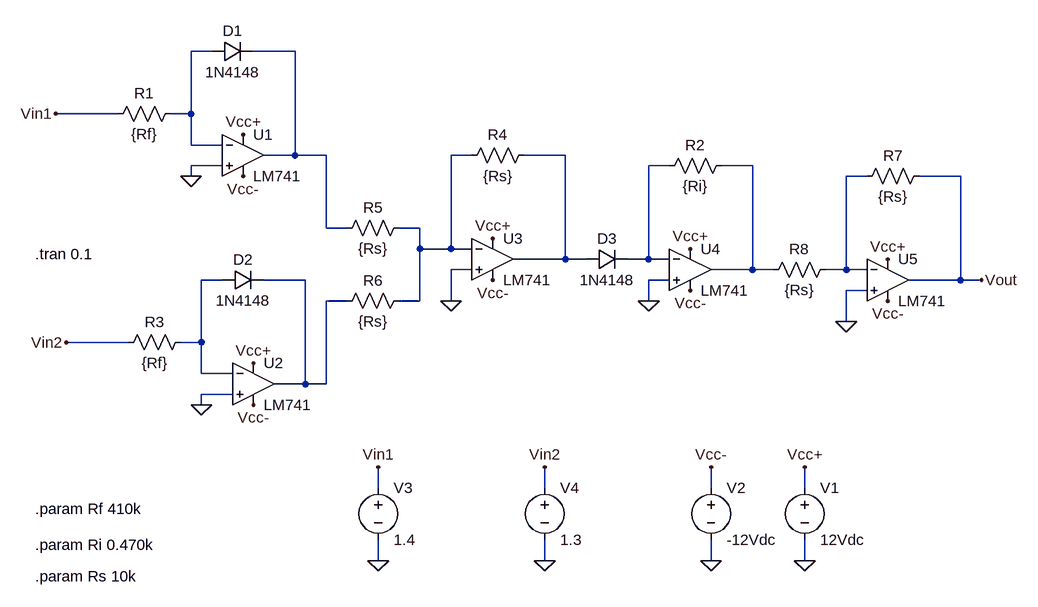
[diagram p0: schematic LtSpice - Schematic.asc]
LtSpice - Schematic.asc, the LTspice schematic file:
Version 4.1
SHEET 1 1108 948
WIRE -352 -304 -384 -304
WIRE -224 -304 -288 -304
WIRE -496 -208 -592 -208
WIRE -384 -208 -384 -304
WIRE -384 -208 -416 -208
WIRE -384 -160 -384 -208
WIRE -336 -160 -384 -160
WIRE -224 -144 -224 -304
WIRE -224 -144 -272 -144
WIRE -176 -144 -224 -144
WIRE 48 -144 16 -144
WIRE 192 -144 128 -144
WIRE -336 -128 -384 -128
WIRE 352 -128 320 -128
WIRE 480 -128 432 -128
WIRE -384 -112 -384 -128
WIRE 656 -112 624 -112
WIRE 800 -112 736 -112
WIRE -176 -32 -176 -144
WIRE -144 -32 -176 -32
WIRE -32 -32 -64 -32
WIRE -32 0 -32 -32
WIRE 16 0 16 -144
WIRE 16 0 -32 0
WIRE 48 0 16 0
WIRE 192 16 192 -144
WIRE 192 16 112 16
WIRE 224 16 192 16
WIRE 320 16 320 -128
WIRE 320 16 288 16
WIRE 352 16 320 16
WIRE 48 32 16 32
WIRE 480 32 480 -128
WIRE 480 32 416 32
WIRE 512 32 480 32
WIRE 624 32 624 -112
WIRE 624 32 592 32
WIRE 656 32 624 32
WIRE -336 48 -368 48
WIRE -208 48 -272 48
WIRE 352 48 320 48
WIRE 800 48 800 -112
WIRE 800 48 720 48
WIRE 832 48 800 48
WIRE 656 64 624 64
WIRE -144 80 -176 80
WIRE -32 80 -32 0
WIRE -32 80 -64 80
WIRE 16 80 16 32
WIRE 320 80 320 48
WIRE 624 112 624 64
WIRE -480 144 -576 144
WIRE -368 144 -368 48
WIRE -368 144 -400 144
WIRE -368 192 -368 144
WIRE -320 192 -368 192
WIRE -208 208 -208 48
WIRE -208 208 -256 208
WIRE -176 208 -176 80
WIRE -176 208 -208 208
WIRE -320 224 -368 224
WIRE -368 240 -368 224
WIRE -96 368 -96 336
WIRE 160 368 160 336
WIRE 416 368 416 336
WIRE 560 368 560 336
WIRE -96 480 -96 448
WIRE 160 480 160 448
WIRE 416 480 416 448
WIRE 560 480 560 448
FLAG -384 -112 0
FLAG 320 80 0
FLAG -368 240 0
FLAG 16 80 0
FLAG 560 480 0
FLAG 560 336 Vcc+
FLAG -304 -176 Vcc+
FLAG 384 0 Vcc+
FLAG 80 -16 Vcc+
FLAG -288 176 Vcc+
FLAG 416 480 0
FLAG 416 336 Vcc-
FLAG 384 64 Vcc-
FLAG 80 48 Vcc-
FLAG -288 240 Vcc-
FLAG -304 -112 Vcc-
FLAG 160 480 0
FLAG 160 336 Vin2
FLAG -96 480 0
FLAG -96 336 Vin1
FLAG -592 -208 Vin1
FLAG -576 144 Vin2
FLAG 624 112 0
FLAG 688 16 Vcc+
FLAG 688 80 Vcc-
FLAG 832 48 Vout
SYMBOL res -400 -224 R90
WINDOW 0 0 56 VBottom 2
WINDOW 3 32 56 VTop 2
SYMATTR InstName R1
SYMATTR Value {Rf}
SYMBOL diode -352 -288 R270
WINDOW 0 32 32 VTop 2
WINDOW 3 0 32 VBottom 2
SYMATTR InstName D1
SYMATTR Value 1N4148
SYMBOL res 448 -144 R90
WINDOW 0 0 56 VBottom 2
WINDOW 3 32 56 VTop 2
SYMATTR InstName R2
SYMATTR Value {Ri}
SYMBOL res -384 128 R90
WINDOW 0 0 56 VBottom 2
WINDOW 3 32 56 VTop 2
SYMATTR InstName R3
SYMATTR Value {Rf}
SYMBOL res 144 -160 R90
WINDOW 0 0 56 VBottom 2
WINDOW 3 32 56 VTop 2
SYMATTR InstName R4
SYMATTR Value {Rs}
SYMBOL res -48 -48 R90
WINDOW 0 0 56 VBottom 2
WINDOW 3 32 56 VTop 2
SYMATTR InstName R5
SYMATTR Value {Rs}
SYMBOL res -48 64 R90
WINDOW 0 0 56 VBottom 2
WINDOW 3 32 56 VTop 2
SYMATTR InstName R6
SYMATTR Value {Rs}
SYMBOL voltage 560 352 R0
WINDOW 123 0 0 Left 0
WINDOW 39 0 0 Left 0
SYMATTR InstName V1
SYMATTR Value 12Vdc
SYMBOL voltage 416 352 R0
SYMATTR InstName V2
SYMATTR Value -12Vdc
SYMBOL res 752 -128 R90
WINDOW 0 0 56 VBottom 2
WINDOW 3 32 56 VTop 2
SYMATTR InstName R7
SYMATTR Value {Rs}
SYMBOL res 608 16 R90
WINDOW 0 0 56 VBottom 2
WINDOW 3 32 56 VTop 2
SYMATTR InstName R8
SYMATTR Value {Rs}
SYMBOL diode -336 64 R270
WINDOW 0 32 32 VTop 2
WINDOW 3 0 32 VBottom 2
SYMATTR InstName D2
SYMATTR Value 1N4148
SYMBOL diode 224 32 R270
WINDOW 0 32 32 VTop 2
WINDOW 3 0 32 VBottom 2
SYMATTR InstName D3
SYMATTR Value 1N4148
SYMBOL OpAmps\\LM741 -304 -208 R0
SYMATTR InstName U1
SYMBOL OpAmps\\LM741 -288 144 R0
SYMATTR InstName U2
SYMBOL OpAmps\\LM741 80 -48 R0
SYMATTR InstName U3
SYMBOL OpAmps\\LM741 384 -32 R0
SYMATTR InstName U4
SYMBOL OpAmps\\LM741 688 -16 R0
SYMATTR InstName U5
SYMBOL voltage -96 352 R0
SYMATTR InstName V3
SYMATTR Value 1.4
SYMBOL voltage 160 352 R0
SYMATTR InstName V4
SYMATTR Value 1.3
TEXT -624 8 Left 2 !.tran 0.1
TEXT -624 400 Left 2 !.param Rf 410k
TEXT -624 456 Left 2 !.param Ri 0.470k
TEXT -624 504 Left 2 !.param Rs 10k

The netlist it stands for:
* LtSpice - Schematic.asc
R1 N001 Vin1 {Rf}
D1 N001 N002 1N4148
R2 N006 N005 {Ri}
R3 N008 Vin2 {Rf}
R4 N004 N003 {Rs}
R5 N003 N002 {Rs}
R6 N003 N009 {Rs}
V1 Vcc+ 0 12Vdc
V2 Vcc- 0 -12Vdc
R7 Vout N007 {Rs}
R8 N007 N006 {Rs}
D2 N008 N009 1N4148
D3 N004 N005 1N4148
X§U1 0 N001 Vcc+ Vcc- N002 LM741  ; pins In+ In- V+ V- OUT
X§U2 0 N008 Vcc+ Vcc- N009 LM741  ; pins In+ In- V+ V- OUT
X§U3 0 N003 Vcc+ Vcc- N004 LM741  ; pins In+ In- V+ V- OUT
X§U4 0 N005 Vcc+ Vcc- N006 LM741  ; pins In+ In- V+ V- OUT
X§U5 0 N007 Vcc+ Vcc- Vout LM741  ; pins In+ In- V+ V- OUT
V3 Vin1 0 1.4
V4 Vin2 0 1.3
.model D D
.lib standard.dio
.tran 0.1
.param Rf 410k
.param Ri 0.470k
.param Rs 10k
.lib LM741.lib
.backanno
.end